# Altium schematic sheet Driver.SchDoc
size A4
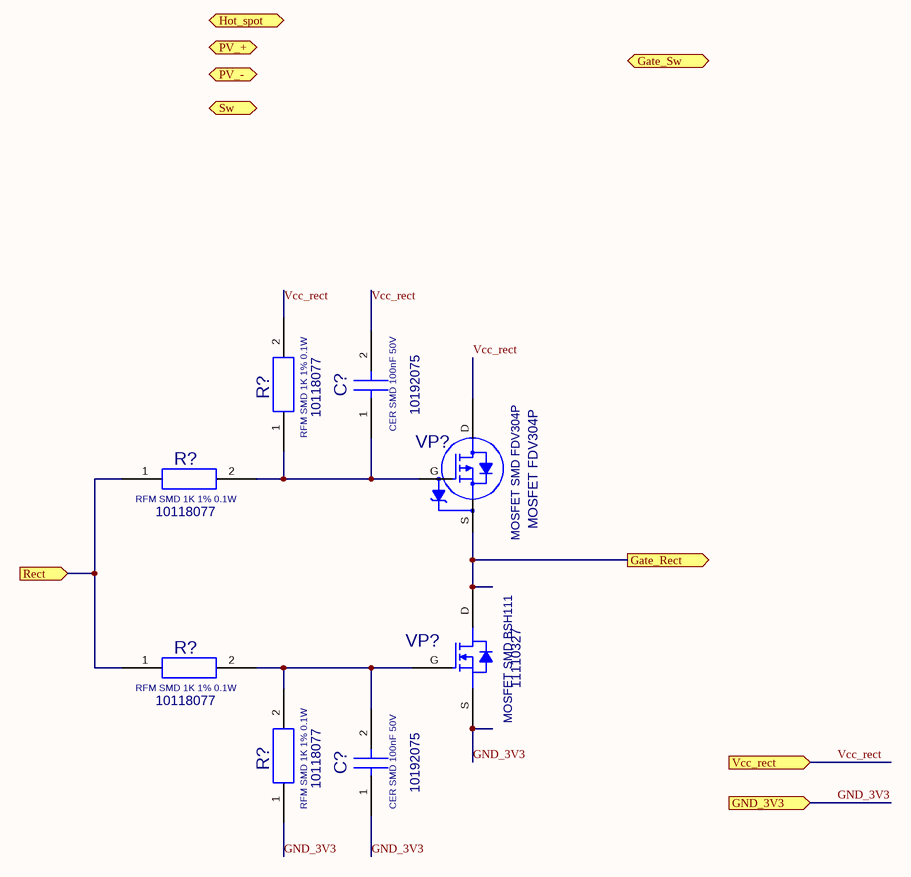
[diagram p0: Driver.SchDoc]

## Parts
(Parts that share a designator on the sheet are numbered #1, #2 ... from top to bottom, then left to right.)
C?#1  10192075  value CER SMD 100nF 50V  [C0805A]
C?#2  10192075  value CER SMD 100nF 50V  [C0805A]
R?#1  10118077  value RFM SMD 1K 1% 0.1W  [R0805A]
R?#2  10118077  value RFM SMD 1K 1% 0.1W  [R0805A]
R?#3  10118077  value RFM SMD 1K 1% 0.1W  [R0805A]
R?#4  10118077  value RFM SMD 1K 1% 0.1W  [R0805A]
VP?#1  MOSFET FDV304P  value MOSFET SMD FDV304P  [MOSFET SOT23A]
VP?#2  11110327  value MOSFET SMD BSH111  [MOS_SOT23A]

## Ports
Gate_Rect (out), Gate_Sw (out), GND_3V3 (in), Hot_spot (in), PV_+ (in), PV_- (in), Rect (in), Sw (in), Vcc_rect (in)

## Nets
Gate_Rect: VP?#1.S VP?#2.D ; port Gate_Rect
GND_3V3: C?#2.1 R?#4.1 VP?#2.S ; port GND_3V3
Rect: R?#2.1 R?#3.1 ; port Rect
Vcc_rect: C?#1.2 R?#1.2 VP?#1.D ; port Vcc_rect
NetC?#1_1: C?#1.1 R?#1.1 R?#2.2 VP?#1.G
NetC?#2_2: C?#2.2 R?#3.2 R?#4.2 VP?#2.G

## Library data of the parts
C?#1 C?#2 = 10192075: CER SMD 100nF 50V; HISsym: Atualizado em 12/07/05; TOL: 10%; ITEM BAAN: 0333.0044; PN: 10192075; PMT: SMD
R?#1-R?#4 = 10118077: RFM SMD 1K 1% 0.1W; HISsym: Atualizado em 20/07/05; PN: 10118077; PMT: SMD
VP?#1 = MOSFET FDV304P: MOSFET SMD FDV304P; PN: xxxxxxxxxxxx; HISitem: Criado em 17/01/13 (p/ Ricardo)
VP?#2 = 11110327: MOSFET SMD BSH111; HISsym: Atualizado em 12/09/05; HISitem: Criado em 20/12/07 (p/ Ricardo); PN: 11110327; PMT: SMD